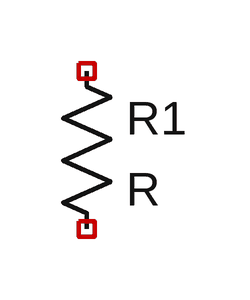
[diagram p0: schematic Semnal.asc]
Semnal.asc, the LTspice schematic file:
Version 4.1
SHEET 1 880 680
SYMBOL res 112 112 R0
SYMATTR InstName R1

The netlist it stands for:
* Semnal.asc
R1 NC_01 NC_02 R
.backanno
.end